# Altium project GPS01-TD.PrjPcb
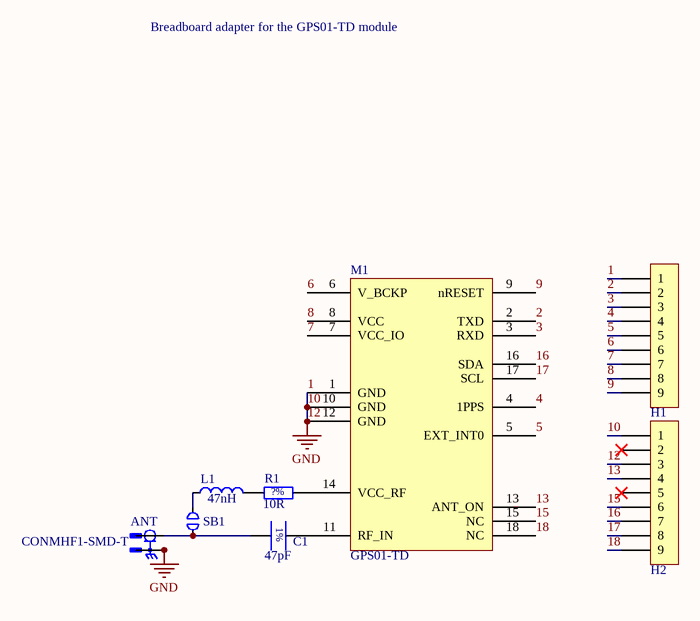
[diagram p0: Schematic.SchDoc]
1 sheet, 8 parts. Net scope: global (net labels, ports and power ports of the same name join across sheets).
Board file: PCB.PcbDoc

## Sheet Schematic.SchDoc
size A4

### Parts
ANT  CONMHF1-SMD-T  [TE_CONMHF1-SMD-T]
C1  47pF  [CAPACITOR_0805_2012M-70N]
H1  HDR,2.54mm,1x9  [HEADER_2.54MM_1x9PIN]  (value not drawn)  (no BOM)
H2  HDR,2.54mm,1x9  [HEADER_2.54MM_1x9PIN]  (value not drawn)  (no BOM)
L1  47nH  [RESISTOR_0805_2012M-50N]
M1  GPS01-TD  [GPS01-TD]
R1  10R  [RESISTOR_0805_2012M-50N]
SB1  Solder Jumper Normally Open  [Solder Bridge Chevron 0402 Open]  (value not drawn)  (no BOM)

### Nets
1: ANT.2(GND) ANT.3(GND) ANT.4(GND) H1.1 H2.1 H2.3 M1.1(GND) M1.10(GND) M1.12(GND)  [also labelled 10, 12, GND]
2: H1.2 M1.2(TXD)
3: H1.3 M1.3(RXD)
4: H1.4 M1.4(1PPS)
5: H1.5 M1.5(EXT_INT0)
6: H1.6 M1.6(V_BCKP)
7: H1.7 M1.7(VCC_IO)
8: H1.8 M1.8(VCC)
9: H1.9 M1.9(nRESET)
13: H2.4 M1.13(ANT_ON)
15: H2.6 M1.15(NC)
16: H2.7 M1.16(SDA)
17: H2.8 M1.17(SCL)
18: H2.9 M1.18(NC)
NetANT_1: ANT.1(SIG) C1.1 SB1.2
NetC1_2: C1.2 M1.11(RF_IN)
NetL1_1: L1.1 SB1.1
NetL1_2: L1.2 R1.1
NetM1_14: M1.14(VCC_RF) R1.2

Not connected (* = marked no-connect by the designer): H2 2* 5*

### Notes on the sheet
- Breadboard adapter for the GPS01-TD module

### Library data of the parts
C1 = Generic Capacitor: Passive - Capacitor, Generic; Tolerance: 1%; MF Part No.: *; Value: 47pF
H1 H2 = HDR,2.54mm,1x9: Connector - 2.54mm, 1x9-pin
L1 = Generic Inductor: Passive - Inductor, Generic; MF Part No.: *; Value: 47nH
R1 = Generic Resistor: Passive - Resistor, Generic; Tolerance: ?%; MF Part No.: *; Value: 10R
ANT = CONMHF1-SMD-T: Package: None; Price: None; Value: *; MP: CONMHF1-SMD-T; Availability: Unavailable
SB1 = Solder Jumper Normally Open: DEBUG: DEBUG